# Altium schematic sheet DDR.SchDoc
size A4
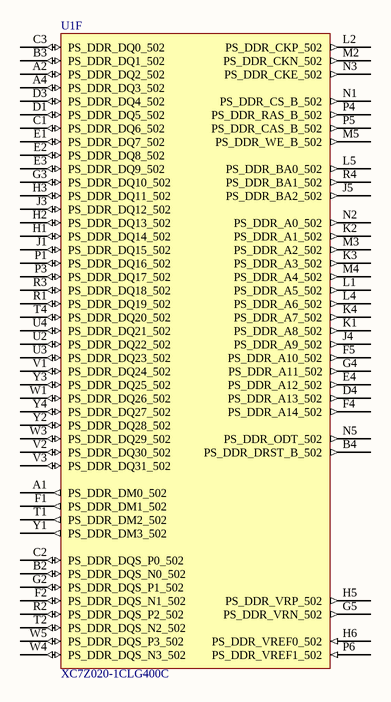
[diagram p0: DDR.SchDoc]

## Parts
U1  XC7Z020-1CLG400C  [CLG400]  (part F of 9)

## Nets

Not connected (* = marked no-connect by the designer): U1 A1(PS_DDR_DM0_502) A2(PS_DDR_DQ2_502) A4(PS_DDR_DQ3_502) B2(PS_DDR_DQS_N0_502) B3(PS_DDR_DQ1_502) B4(PS_DDR_DRST_B_502) C1(PS_DDR_DQ6_502) C2(PS_DDR_DQS_P0_502) C3(PS_DDR_DQ0_502) D1(PS_DDR_DQ5_502) D3(PS_DDR_DQ4_502) D4(PS_DDR_A13_502) E1(PS_DDR_DQ7_502) E2(PS_DDR_DQ8_502) E3(PS_DDR_DQ9_502) E4(PS_DDR_A12_502) F1(PS_DDR_DM1_502) F2(PS_DDR_DQS_N1_502) F4(PS_DDR_A14_502) F5(PS_DDR_A10_502) G2(PS_DDR_DQS_P1_502) G3(PS_DDR_DQ10_502) G4(PS_DDR_A11_502) G5(PS_DDR_VRN_502) H1(PS_DDR_DQ14_502) H2(PS_DDR_DQ13_502) H3(PS_DDR_DQ11_502) H5(PS_DDR_VRP_502) H6(PS_DDR_VREF0_502) J1(PS_DDR_DQ15_502) J3(PS_DDR_DQ12_502) J4(PS_DDR_A9_502) J5(PS_DDR_BA2_502) K1(PS_DDR_A8_502) K2(PS_DDR_A1_502) K3(PS_DDR_A3_502) K4(PS_DDR_A7_502) L1(PS_DDR_A5_502) L2(PS_DDR_CKP_502) L4(PS_DDR_A6_502) L5(PS_DDR_BA0_502) M2(PS_DDR_CKN_502) M3(PS_DDR_A2_502) M4(PS_DDR_A4_502) M5(PS_DDR_WE_B_502) N1(PS_DDR_CS_B_502) N2(PS_DDR_A0_502) N3(PS_DDR_CKE_502) N5(PS_DDR_ODT_502) P1(PS_DDR_DQ16_502) P3(PS_DDR_DQ17_502) P4(PS_DDR_RAS_B_502) P5(PS_DDR_CAS_B_502) P6(PS_DDR_VREF1_502) R1(PS_DDR_DQ19_502) R2(PS_DDR_DQS_P2_502) R3(PS_DDR_DQ18_502) R4(PS_DDR_BA1_502) T1(PS_DDR_DM2_502) T2(PS_DDR_DQS_N2_502) T4(PS_DDR_DQ20_502) U2(PS_DDR_DQ22_502) U3(PS_DDR_DQ23_502) U4(PS_DDR_DQ21_502) V1(PS_DDR_DQ24_502) V2(PS_DDR_DQ30_502) V3(PS_DDR_DQ31_502) W1(PS_DDR_DQ26_502) W3(PS_DDR_DQ29_502) W4(PS_DDR_DQS_N3_502) W5(PS_DDR_DQS_P3_502) Y1(PS_DDR_DM3_502) Y2(PS_DDR_DQ28_502) Y3(PS_DDR_DQ25_502) Y4(PS_DDR_DQ27_502)

## Library data of the parts
U1 = XC7Z020-1CLG400C: 667 MHz Zynq?7000 AP SoC, 130 PS I/O, 125 FPGA I/O, 400-Ball BGA, Speed Grade 1, Commercial Grade, Pb-Free; Manufacturer: Xilinx; Extensible Block RAM (# 36Kb Blocks): 560 KB (140); Flip Flops: 106400; LUTs: 53200; Speed Grade: -1; DatasheetVersion: v1.2; PackageVersion: Rev 1.1; PackageReference: CLG400; PackageDescription: Wire-Bond Chip-Scale BGA, Body 17 x 17 mm, 0.8 mm Pitch; Generic Part Number: XC7Z020; RoHS: Pb-Free; Mounting Technology: Surface Mount; Code_JEDEC: MO-275-MMAA-1; PartNumber: XC7Z020-1CLG400C; ComponentLink1Description: Datasheet; ComponentLink1URL: http://www.xilinx.com/support/documentation/data_sheets/ds190-Zynq-7000-Overview.pdf; ComponentLink2Description: Package Specification; ComponentLink2URL: http://www.xilinx.com/support/documentation/user_guides/ug865-Zynq-7000-Pkg-Pinout.pdf; ComponentLink3Description: DC and AC Switching Characteristics; ComponentLink3URL: http://www.xilinx.com/support/documentation/data_sheets/ds187-XC7Z010-XC7Z020-Data-Sheet.pdf; ComponentLink4Description: Package File; ComponentLink4URL: http://www.xilinx.com/support/packagefiles/z7packages/xc7z020clg400pkg.txt; ComponentLink5Description: Packaging and Pinout; ComponentLink5URL: http://www.xilinx.com/support/documentation/user_guides/ug865-Zynq-7000-Pkg-Pinout.pdf; ComponentLink6Description: PCB and Layout Guide; ComponentLink6URL: http://www.xilinx.com/support/documentation/user_guides/ug483_7Series_PCB.pdf